# Altium schematic sheet AirSystem8266PCB.SchDoc
size A3
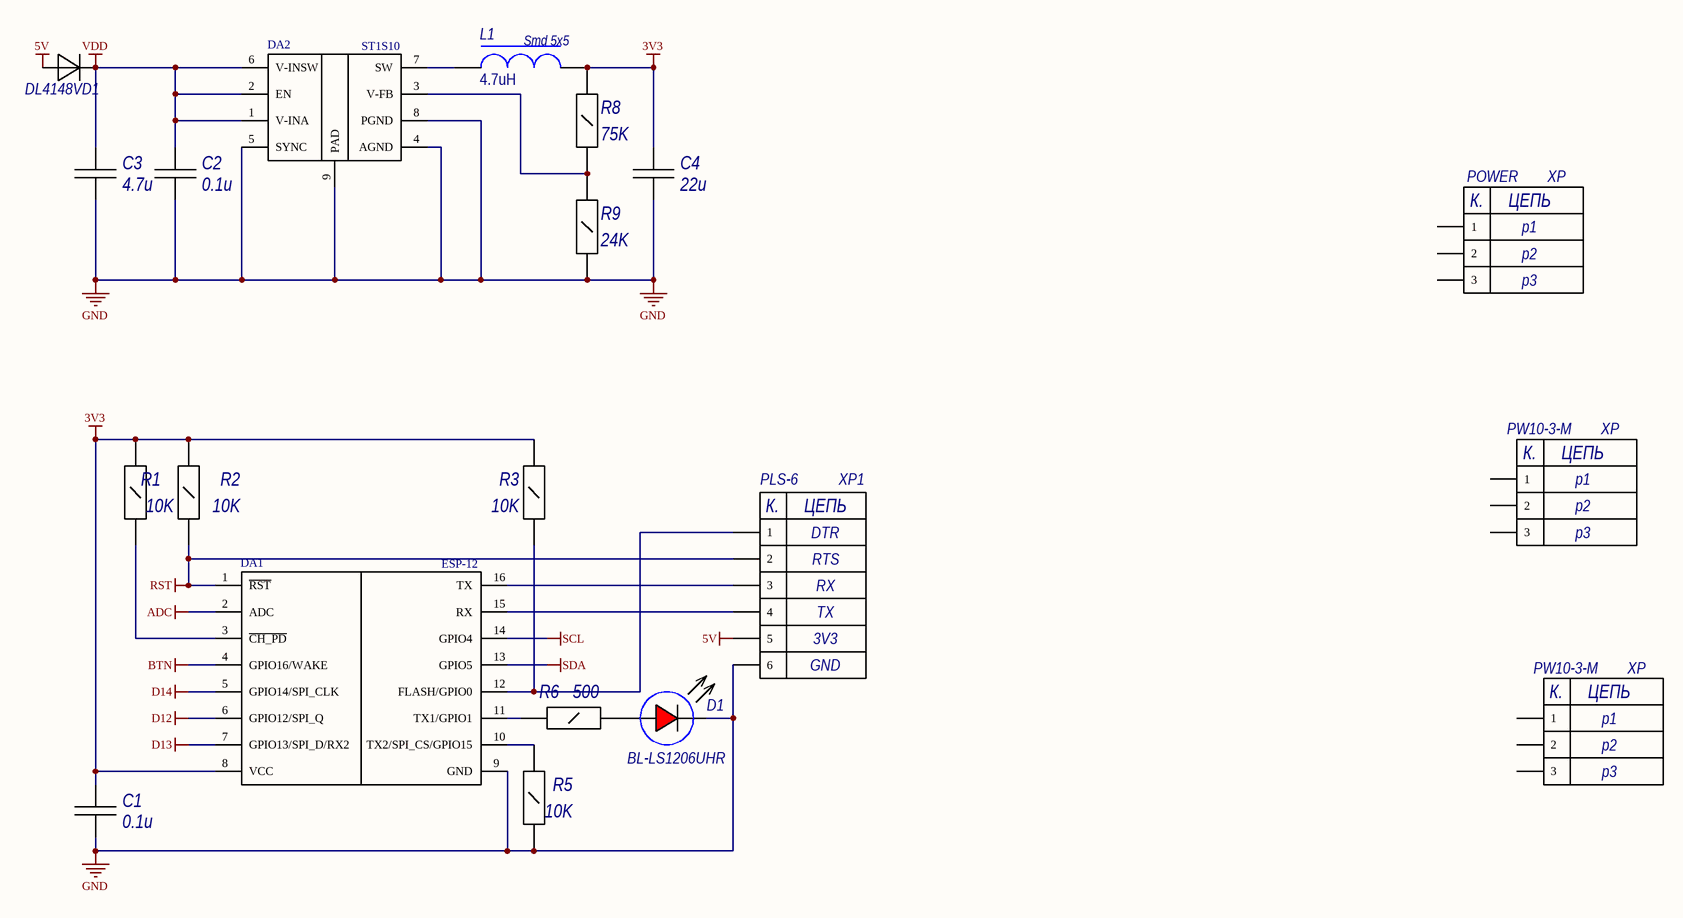
[diagram p0: AirSystem8266PCB.SchDoc]

## Parts
(Parts that share a designator on the sheet are numbered #1, #2 ... from top to bottom, then left to right.)
C1  0.1u  [C1206]
C2  0.1u  [C1206]
C3  4.7u  [C1206]
C4  22u  [C1206]
D1  BL-LS1206UHR  [BL-LC1206]
DA1  ESP-12  [ESP-12]
DA2  ST1S10  [SO-8_Power]
L1  4.7uH  [SMD 5x5]
R1  10K  [1206]
R2  10K  [1206]
R3  10K  [1206]
R5  10K  [1206]
R6  500  [1206]
R8  75K  [1206]
R9  24K  [1206]
VD1  DL4148  [DO-213AA(SOD80)]
XP1  PLS-6  [PLS-6_1]
XP#1  POWER  [PW10-3-M2]
XP#2  PW10-3-M  [PW10-3-M2]
XP#3  PW10-3-M  [PW10-3-M2]

## Nets
3V3: C1.1 C4.1 DA1.8(VCC) L1.2 R1.1 R2.1 R3.1 R8.2
5V: VD1.2 XP1.5
ADC: DA1.2(ADC)
BTN: DA1.4(GPIO16/WAKE)
D12: DA1.6(GPIO12/SPI_Q)
D13: DA1.7(GPIO13/SPI_D/RX2)
D14: DA1.5(GPIO14/SPI_CLK)
GND: C1.2 C2.2 C3.2 C4.2 D1.1 DA1.9(GND) DA2.4(AGND) DA2.5(SYNC) DA2.8(PGND) DA2.9(PAD) R5.2 R9.1 XP1.6
RST: DA1.1(~{RST}) R2.2 XP1.2
SCL: DA1.14(GPIO4)
SDA: DA1.13(GPIO5)
VDD: C2.1 C3.1 DA2.1(V-INA) DA2.2(EN) DA2.6(V-INSW) VD1.1
NetD1_2: D1.2 R6.1
NetDA1_3: DA1.3(~{CH_PD}) R1.2
NetDA1_10: DA1.10(TX2/SPI_CS/GPIO15) R5.1
NetDA1_11: DA1.11(TX1/GPIO1) R6.2
NetDA1_12: DA1.12(FLASH/GPIO0) R3.2 XP1.1
NetDA1_15: DA1.15(RX) XP1.4
NetDA1_16: DA1.16(TX) XP1.3
NetDA2_3: DA2.3(V-FB) R8.1 R9.2
NetDA2_7: DA2.7(SW) L1.1

Not connected (* = marked no-connect by the designer): XP#1 1 2 3; XP#2 1 2 3; XP#3 1 2 3

## Notes on the sheet
- (in symbol PLS-6) К.; ЦЕПЬ; DTR; RTS; RX; TX; 3V3; GND
- (in symbol PW10-3-M) К.; ЦЕПЬ

## Library data of the parts
C1-C4 = SMD_1206
D1 = KP-3216SURCK
DA2 = ST1S10 Step-down 3A
L1 = Smd 5x5: FootPrint: Smd 5x5
R1-R3 R5 R6 R8 R9 = 1206
XP#1 = PW10-3-M: p1: p1; p2: p2; p3: p3
XP#2 XP#3 = PW10-3-M: p1: p1; p2: p2; p3: p3